# EAGLE schematic 04C-003 (EAGLE 6.3)
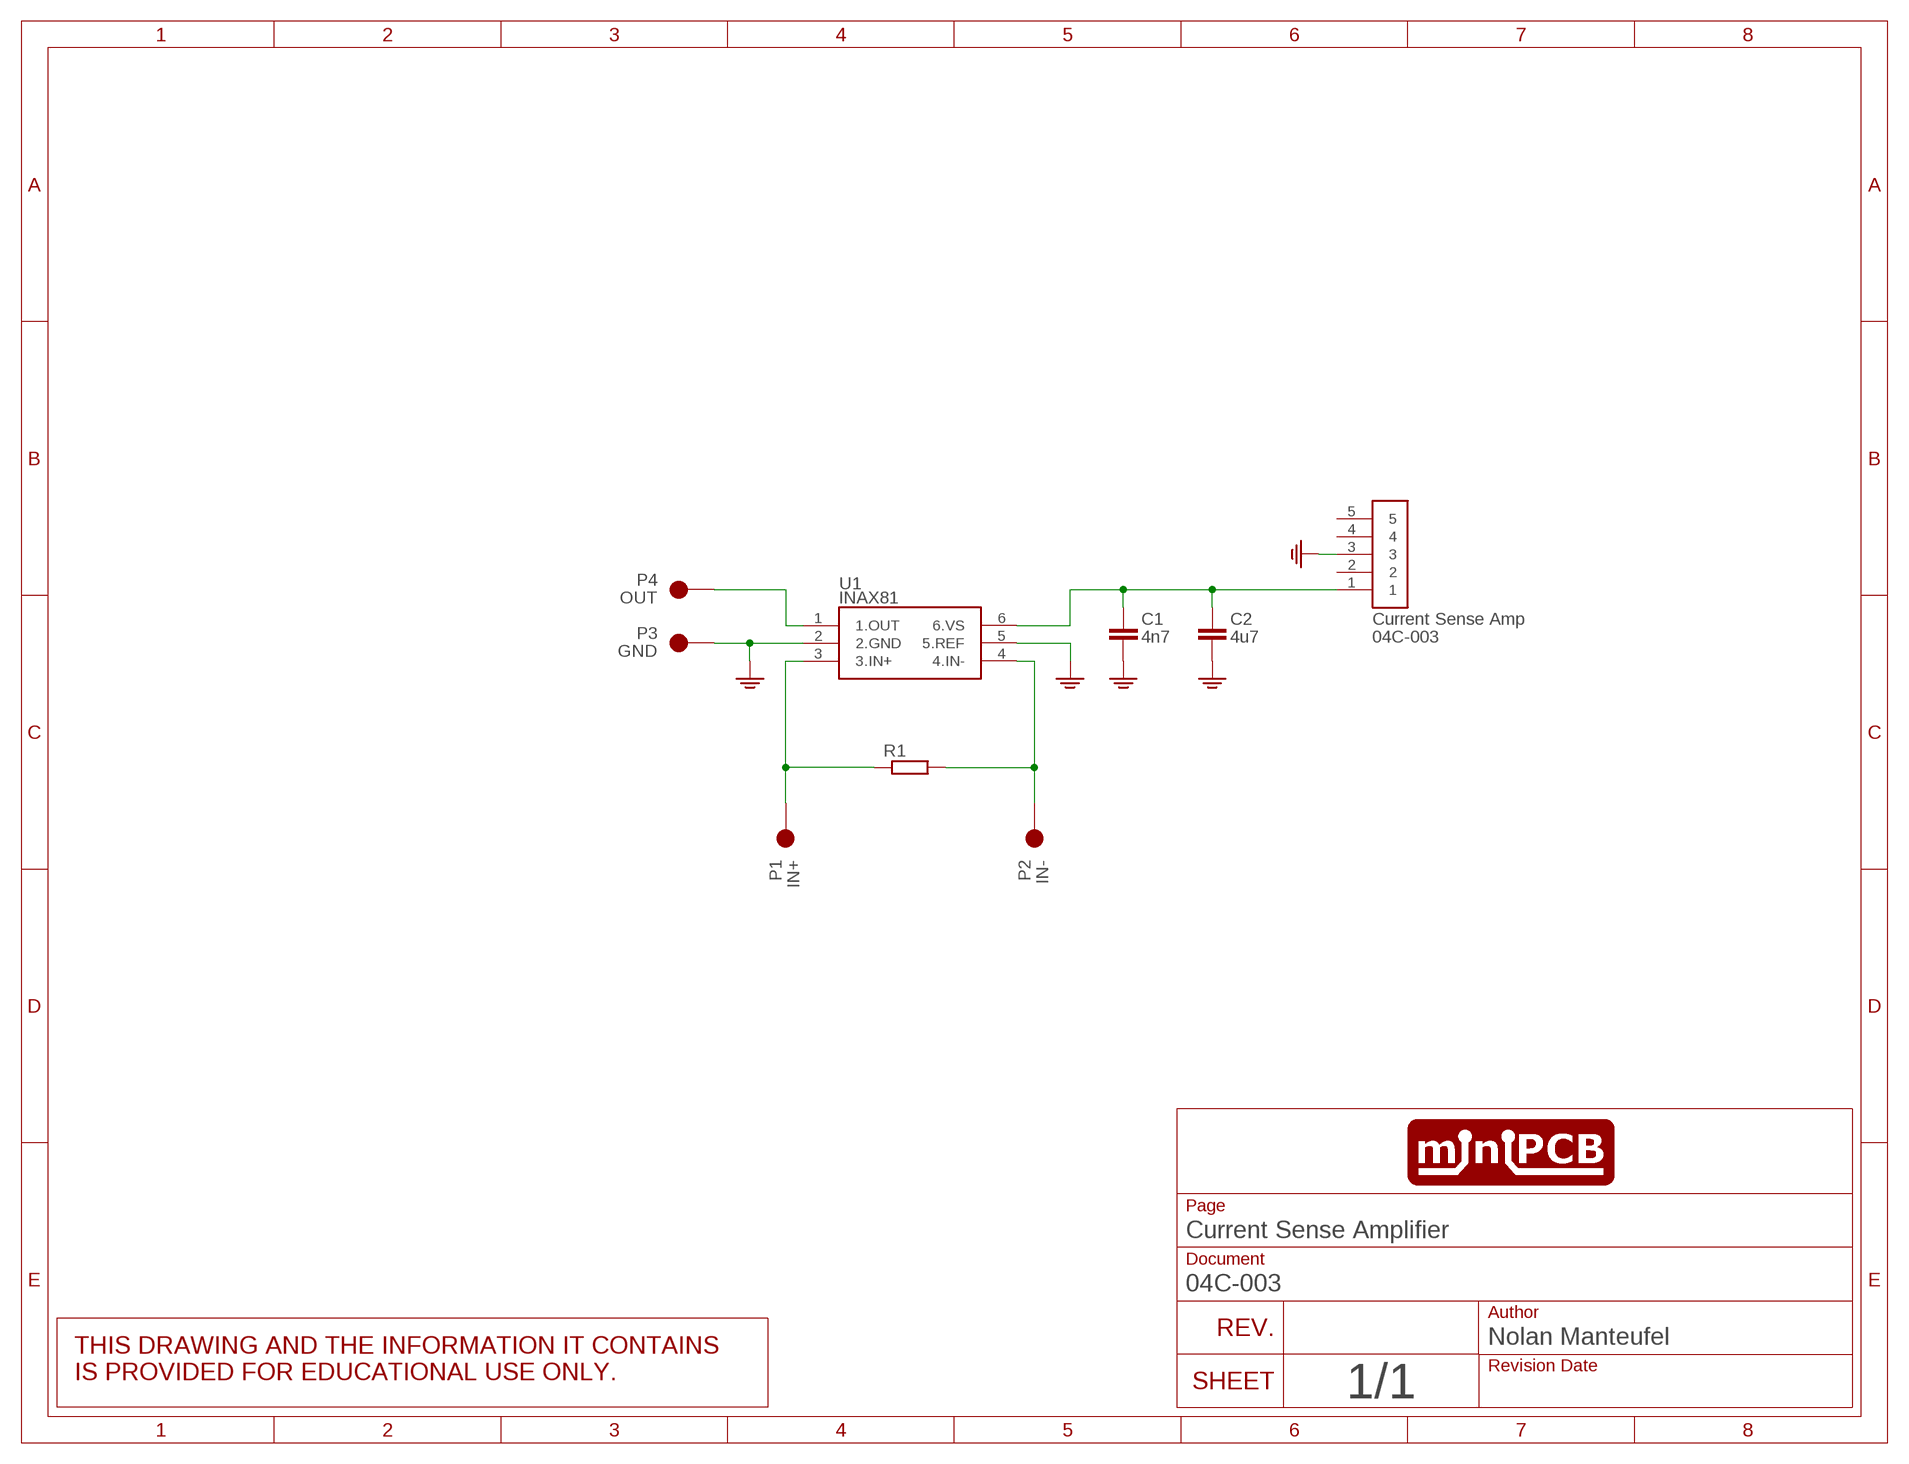
[diagram p0: schematic, sheet 1]

## Parts
04C-003  Current Sense Amp  MINIPCB_5P25MM  [MINIPCB_25X25MM]
C1  4n7  C-EUC0603  [C0603]
C2  4u7  C-EUC0603  [C0603]
P1  IN+  PINS_124AWG-K  [PINS_1_1MM_K]
P2  IN-  PINS_124AWG-K  [PINS_1_1MM_K]
P3  GND  PINS_124AWG-K  [PINS_1_1MM_K]
P4  OUT  PINS_124AWG-K  [PINS_1_1MM_K]
R1  R-EU_R2512K  [R2512K]
U1  INAX81  [SOT23-6]

## Nets
GND: 04C-003.3 C1.2 C2.2 P3.1 P3.2 U1.2(2.GND) U1.5(5.REF)
IN+: P1.1 P1.2 R1.1 U1.3(3.IN+)
IN-: P2.1 P2.2 R1.2 U1.4(4.IN-)
N$3: P4.1 P4.2 U1.1(1.OUT)
N$4: 04C-003.1 C1.1 C2.1 U1.6(6.VS)
Unconnected: 04C-003.2 04C-003.4 04C-003.5

## Library data of the parts
04C-003 = nolan-utsa:MINIPCB_5P
C1 C2 = nolan-utsa:C-EU: CAPACITOR, European symbol
P1-P4 = nolan:PINS_1
R1 = nolan:R-EU_: RESISTOR, European symbol
U1 = nolan-utsa:INAX81: INAx181 Bidirectional, Low- and High-Side Voltage Output, Current-Sense Amplifier